# EAGLE design manyMelody (EAGLE 8.7.0)
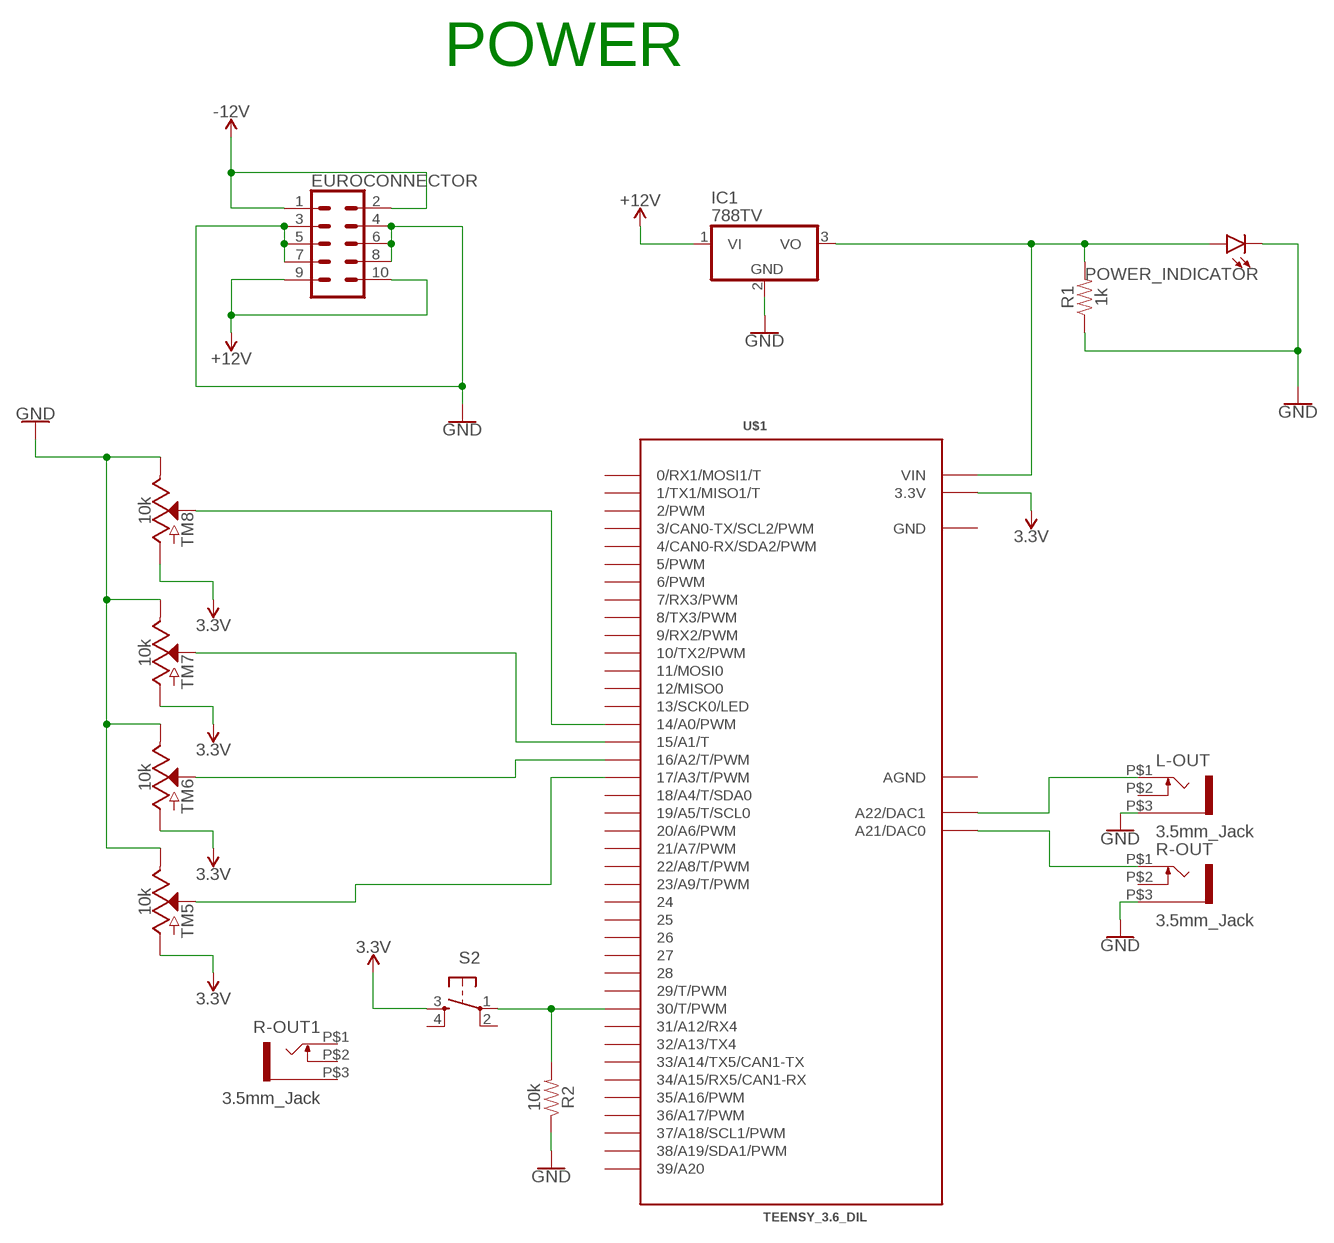
[diagram p0: schematic, sheet 1]

## Parts
EUROCONNECTOR  CONN_05X2SHD  [2X5-SHROUDED]
IC1  788TV  [TO220V]
L-OUT  3.5mm_Jack  WQP-PJ301M-12_JACK  [WQP-PJ301M-12_JACK]
POWER_INDICATOR  LED5MM  [LED_5MM]
R1  1k  1KOHM-HORIZ-1/4W-5%  [AXIAL-0.3]
R2  10k  1KOHM-HORIZ-1/4W-5%  [AXIAL-0.3]
R-OUT  3.5mm_Jack  WQP-PJ301M-12_JACK  [WQP-PJ301M-12_JACK]
R-OUT1  3.5mm_Jack  WQP-PJ301M-12_JACK  [WQP-PJ301M-12_JACK]
S2  TAC_SWITCHPTH  [TACTILE-PTH]
TM5  10k  POTENTIOMETER-PTH-9MM-1/20W-20%  [POT-PTH-ALPS]
TM6  10k  POTENTIOMETER-PTH-9MM-1/20W-20%  [POT-PTH-ALPS]
TM7  10k  POTENTIOMETER-PTH-9MM-1/20W-20%  [POT-PTH-ALPS]
TM8  10k  POTENTIOMETER-PTH-9MM-1/20W-20%  [POT-PTH-ALPS]
U$1  TEENSY_3.6_DIL  [TEENSY_3.6_DIL]

## Nets
3.3V: S2.3 TM5.P$3(A) TM6.P$3(A) TM7.P$3(A) TM8.P$3(A) U$1.3.3V U$1.3.3V3(3.3V)
5V: IC1.3(VO) POWER_INDICATOR.A R1.P$2 U$1.VIN
+12V: EUROCONNECTOR.9 EUROCONNECTOR.10 IC1.1(VI)
-12V: EUROCONNECTOR.1 EUROCONNECTOR.2
GND: EUROCONNECTOR.3 EUROCONNECTOR.4 EUROCONNECTOR.5 EUROCONNECTOR.6 EUROCONNECTOR.7 EUROCONNECTOR.8 IC1.2(GND) L-OUT.P$3 POWER_INDICATOR.K(C) R1.P$1 R2.P$1 R-OUT.P$3 TM5.P$1(E) TM6.P$1(E) TM7.P$1(E) TM8.P$1(E)
N$3: R2.P$2 S2.1 U$1.30(30/T/PWM)
N$9: L-OUT.P$1 U$1.A22(A22/DAC1)
N$10: R-OUT.P$1 U$1.A21(A21/DAC0)
N$11: TM8.P$2(S) U$1.14/A0(14/A0/PWM)
N$12: TM7.P$2(S) U$1.15/A1(15/A1/T)
N$13: TM6.P$2(S) U$1.16/A2(16/A2/T/PWM)
N$14: TM5.P$2(S) U$1.17/A3(17/A3/T/PWM)
Unconnected: L-OUT.P$2 R-OUT1.P$1 R-OUT1.P$2 R-OUT1.P$3 R-OUT.P$2 S2.2 S2.4 U$1.0(0/RX1/MOSI1/T) U$1.1(1/TX1/MISO1/T) U$1.2(2/PWM) U$1.3(3/CAN0-TX/SCL2/PWM) U$1.4(4/CAN0-RX/SDA2/PWM) U$1.5(5/PWM) U$1.6(6/PWM) U$1.7(7/RX3/PWM) U$1.8(8/TX3/PWM) U$1.9(9/RX2/PWM) U$1.10(10/TX2/PWM) U$1.11(11/MOSI0) U$1.12(12/MISO0) U$1.13(13/SCK0/LED) U$1.18/A4(18/A4/T/SDA0) U$1.19/A5(19/A5/T/SCL0) U$1.20/A6(20/A6/PWM) U$1.21/A7(21/A7/PWM) U$1.22/A8(22/A8/T/PWM) U$1.23/A9(23/A9/T/PWM) U$1.24 U$1.25 U$1.26 U$1.27 U$1.28 U$1.29(29/T/PWM) U$1.31/A12(31/A12/RX4) U$1.32/A13(32/A13/TX4) U$1.33/A14(33/A14/TX5/CAN1-TX) U$1.34/A15(34/A15/RX5/CAN1-RX) U$1.35/A16(35/A16/PWM) U$1.36/A17(36/A17/PWM) U$1.37/A18(37/A18/SCL1/PWM) U$1.38/A19(38/A19/SDA1/PWM) U$1.39/A20

## Notes on the sheet
- POWER

## Power pins joined to a net without a drawn wire
AGND: U$1.AGND
GND: U$1.GND U$1.GND1(GND)

## Library data of the parts
EUROCONNECTOR = SparkFun-Connectors:CONN_05X2: Multi connection point. Often used as Generic Header-pin footprint for 0.1 inch spaced/style header connections For AVR SPI programming port, see special device with nice symbol: "AVR_SPI_PROG_5x2.dev" You can populate with any combo of single row headers, but if you'd like an exact match, check these: 2x5 AVR ICSP Male Header <https://www.sparkfun.com/products/778> (PRT-00778) 2x5 Pin Shrouded Header <https://www.sparkfun.com/products/8506> (PRT-08506) On any of the 0.1 inch spaced packages, you can populate with these: Break Away Headers - Straight <https://www.sparkfun.com/products/116> (PRT-00116) Break Away Male Headers - Right Angle <https://www.sparkfun.com/products/553> (PRT-00553) Female Headers <https://www.sparkfun.com/products/115> (PRT-00115) Break Away Headers - Machine Pin <https://www.sparkfun.com/products/117> (PRT-00117) Break Away Female Headers - Swiss Machine Pin <https://www.sparkfun.com/products/743> (PRT-00743) Special note: the shrouded connector mates well with our 5x2 ribbon cables: 2x5 Pin IDC Ribbon Cable <https://www.sparkfun.com/products/8535> (PRT-08535); PROD_ID: CONN-08671; SF_ID: PRT-08506
IC1 = linear:78*: Positive VOLTAGE REGULATOR Source: http://cache.national.com/ds/LM/LM78L05.pdf http://www.fairchildsemi.com/ds/LM/LM7805.pdf
L-OUT R-OUT R-OUT1 = thonkiconn:WQP-PJ301M-12_JACK
POWER_INDICATOR = SparkFun-LED:LED: LED (Generic) Standard schematic elements and footprints for 5mm, 3mm, 1206, and 0603 sized LEDs. Generic LEDs with no color specified.
R1 = SparkFun-Resistors:1KOHM: 1kΩ resistor A resistor is a passive two-terminal electrical component that implements electrical resistance as a circuit element. Resistors act to reduce current flow, and, at the same time, act to lower voltage levels within circuits. - Wikipedia; PROD_ID: RES-08380
R2 = SparkFun-Resistors:1KOHM: 1kΩ resistor A resistor is a passive two-terminal electrical component that implements electrical resistance as a circuit element. Resistors act to reduce current flow, and, at the same time, act to lower voltage levels within circuits. - Wikipedia; PROD_ID: RES-08380; VALUE: 1k
S2 = SparkFun-Retired:TAC_SWITCH: Momentary Switch Button commonly used for reset or general input. Spark Fun Electronics SKU : COM-00097 SMT- SWCH-08247
TM5-TM8 = SparkFun-Resistors:POTENTIOMETER: Potentiometer (Pot) Three-terminal potentiometers, with an adjustable wiper and two adjustable resistors. A pot can be used to create a configurable voltage divider, or as a variable resistor. Variants ALPS_POT and ALPS_POT_KIT - PTH, breadboard compatible, 9mm square pots Rotary Potentiometer - Linear (10k ohm) <https://www.sparkfun.com/products/9288> (COM-09288) The KIT variant exposes copper on only one side of the PTH pad, so the part can only be assembled on one side of the PCB. Useful for beginner soldering kits.; PROD_ID: RES-09177; SF_SKU: COM-09288
U$1 = Teensy_3_and_LC_Series_Boards_v1.4:TEENSY_3.6_DIL: Teensy 3.6 DIL Package

## Board
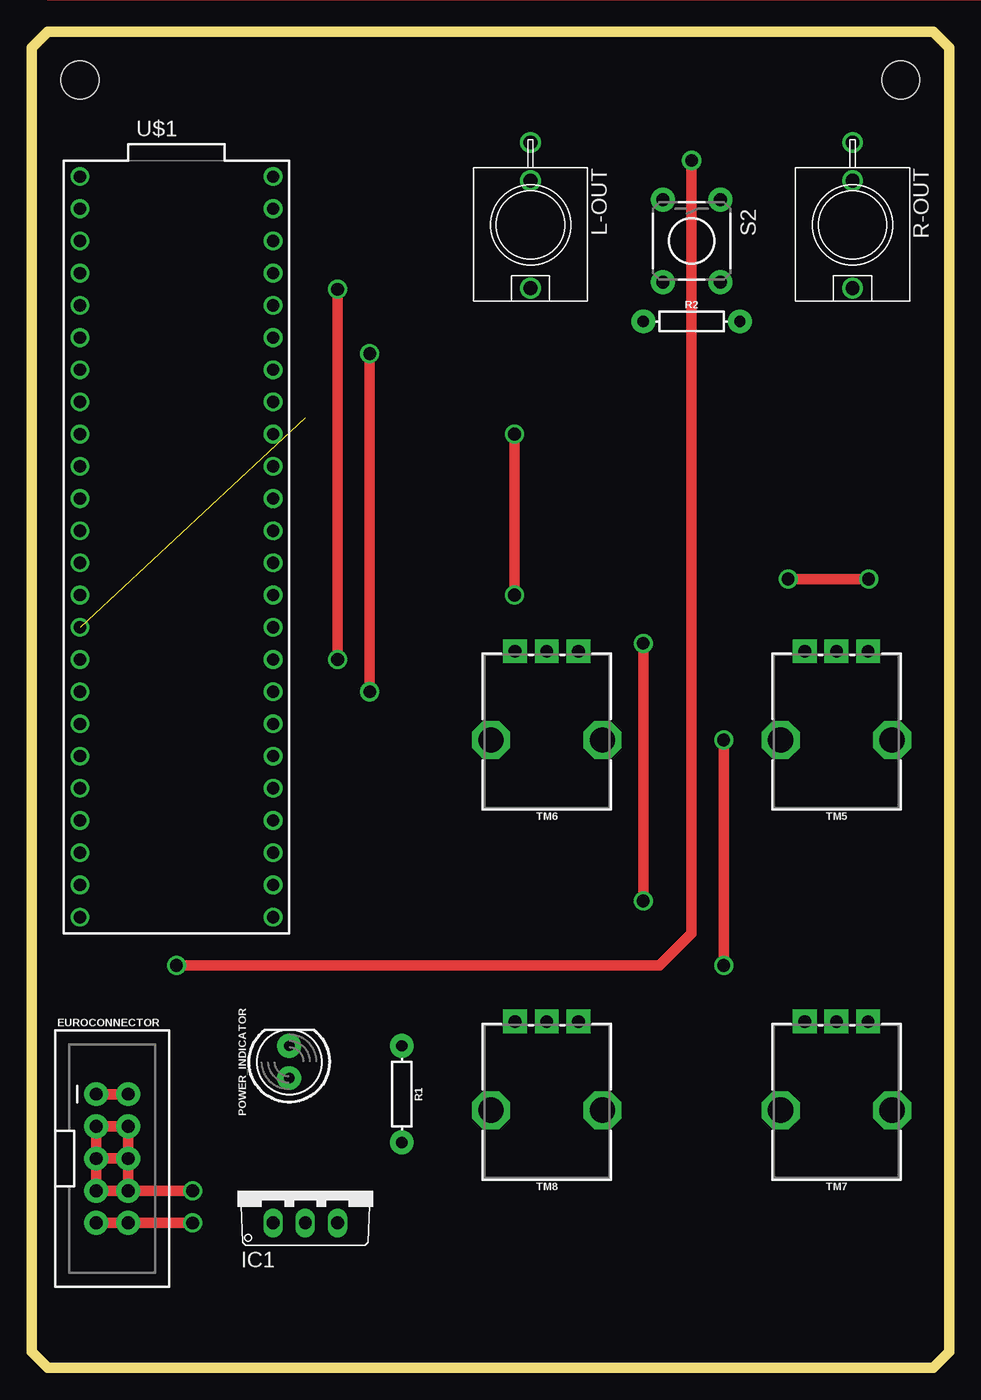
[diagram p1: board, top side]
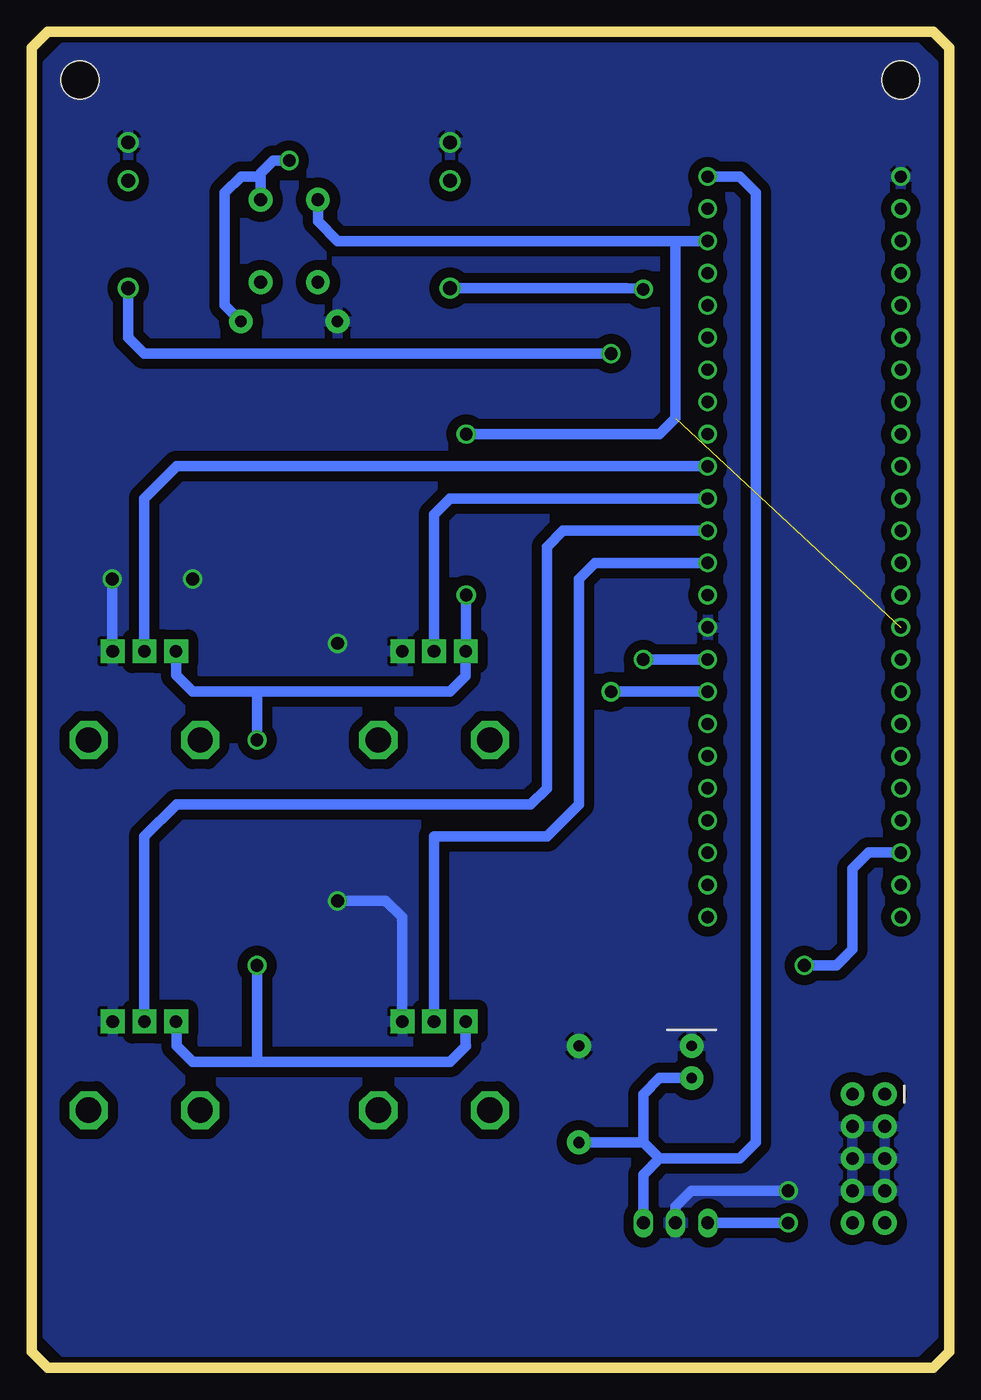
[diagram p2: board, bottom side, seen from below]

Size 72.39 x 105.41 mm. Coordinates in mm from the lower left corner, seen from the top.
Outline: 0,1.27 1.27,0 71.12,0 72.39,1.27 72.39,104.14 71.12,105.41 1.27,105.41 0,104.14 0,1.27
Copper layers (1*16): Top 0.035mm / dielectric 1.5mm / Bottom 0.035mm
Design rules "OthermillDRC_1_32_v2": minimum track width 8mil, minimum drill 0.8mm, track to track 0.794003125mm, track to pad 0.794003125mm, pad to pad 0.794003125mm, via to via 0.794003125mm, smd to smd 0mil, copper to edge 0mil, drill to drill 1mil, minimum pad ring 10mil, minimum via ring 10mil, stop-mask expansion 1mil, vias tented up to drill 30mil, thermal gap 10mil
Holes 3 mm at 68.58,101.6 3.81,101.6

### Footprints (pad centres in the part's own frame; a part is rotated, then mirrored left to right if it is on the bottom)
2X5-SHROUDED = drill 1.016 pad 1.88: 1 -1.27,5.08; 2 1.27,5.08; 3 -1.27,2.54; 4 1.27,2.54; 5 -1.27,0; 6 1.27,0; 7 -1.27,-2.54; 8 1.27,-2.54; 9 -1.27,-5.08; 10 1.27,-5.08
TO220V = drill 1.016 long: 1 -2.54,-2.54; 2 0,-2.54; 3 2.54,-2.54
WQP-PJ301M-12_JACK = drill 1.1: P$1 0,5; P$2 0,-3.5; P$3 0,-6.5
LED_5MM = drill 0.813 pad 1.88: A -1.27,0; K 1.27,0
AXIAL-0.3 = drill 0.9 pad 1.88: P$1 -3.81,0; P$2 3.81,0
TACTILE-PTH = drill 1.016 pad 1.88: 1 -3.251,2.261; 2 3.251,2.261; 3 -3.251,-2.261; 4 3.251,-2.261
POT-PTH-ALPS = drill 1 pad 1.88 square: P$1 7,-2.5; P$2 7,0; P$3 7,2.5 | drill 2 octagon: P$4 0,-4.4; P$5 0,4.4
TEENSY_3.6_DIL = drill 0.965: 0 -7.62,25.4; 1 -7.62,22.86; 2 -7.62,20.32; 3 -7.62,17.78; 3.3V 7.62,22.86; 3.3V3 -7.62,-7.62; 4 -7.62,15.24; 5 -7.62,12.7; 6 -7.62,10.16; 7 -7.62,7.62; 8 -7.62,5.08; 9 -7.62,2.54; 10 -7.62,0; 11 -7.62,-2.54; 12 -7.62,-5.08; 13 7.62,-5.08; 14/A0 7.62,-2.54; 15/A1 7.62,0; 16/A2 7.62,2.54; 17/A3 7.62,5.08; 18/A4 7.62,7.62; 19/A5 7.62,10.16; 20/A6 7.62,12.7; 21/A7 7.62,15.24; 22/A8 7.62,17.78; 23/A9 7.62,20.32; 24 -7.62,-10.16; 25 -7.62,-12.7; 26 -7.62,-15.24; 27 -7.62,-17.78; 28 -7.62,-20.32; 29 -7.62,-22.86; 30 -7.62,-25.4; 31/A12 -7.62,-27.94; 32/A13 -7.62,-30.48; 33/A14 7.62,-30.48; 34/A15 7.62,-27.94; 35/A16 7.62,-25.4; 36/A17 7.62,-22.86; 37/A18 7.62,-20.32; 38/A19 7.62,-17.78; 39/A20 7.62,-15.24; A21 7.62,-12.7; A22 7.62,-10.16; AGND 7.62,25.4; GND -7.62,27.94; GND1 7.62,-7.62; VIN 7.62,27.94

### Placement (x,y rotation side)
EUROCONNECTOR  6.35,16.51 0 top
IC1  21.59,13.97 0 top
L-OUT  39.37,90.17 180 top
POWER_INDICATOR  20.32,24.13 90 top
R1  29.21,21.59 270 top
R2  52.07,82.55 0 top
R-OUT  64.77,90.17 180 top
R-OUT1  -115.57,-110.49 0 top  (outside the outline)
S2  52.07,88.9 270 top
TM5  63.5,49.53 90 top
TM6  40.64,49.53 90 top
TM7  63.5,20.32 90 top
TM8  40.64,20.32 90 top
U$1  11.43,66.04 0 top

### Tracks (layer width: path | path; a pad name or v marks a point on that pad's centre or on a via)
3.3V  (via drill 1)  (1 unrouted)
  Top 0.813: v38.1,73.66 v38.1,60.96 | v54.61,31.75 v54.61,49.53
  Bottom 0.813: 54.61,53.34 39.37,53.34 38.14,54.57 TM6.P$3 38.1,56.57 v38.1,60.96 | 54.61,53.34 59.69,53.34 61,54.65 TM5.P$3 | TM8.P$3 38.14,25.44 38.1,25.4 39.37,24.13 54.61,24.13 | 54.61,24.13 59.69,24.13 60.96,25.4 60.96,27.28 TM7.P$3 | S2.3 49.81,90.45 48.26,88.9 21.59,88.9 | U$1.3.3V 21.59,88.9 | v38.1,73.66 22.86,73.66 21.59,74.93 21.59,88.9 | 54.61,24.13 v54.61,31.75 | v54.61,49.53 54.61,53.34
5V
  Bottom 0.813: IC1.3 24.13,15.24 22.86,16.51 | 22.86,16.51 16.51,16.51 15.24,17.78 15.24,92.71 16.51,93.98 U$1.VIN | 22.86,16.51 24.13,17.78 | 24.13,17.78 24.13,21.59 22.86,22.86 POWER_INDICATOR.A | 24.13,17.78 R1.P$2
+12V  (via drill 1)
  Top 0.813: EUROCONNECTOR.9 EUROCONNECTOR.10 v12.7,11.43
  Bottom 0.813: v12.7,11.43 IC1.1
-12V
  Top 0.813: EUROCONNECTOR.1 EUROCONNECTOR.2
GND  (via drill 1)
  Top 0.813: EUROCONNECTOR.8 EUROCONNECTOR.7 EUROCONNECTOR.5 | EUROCONNECTOR.8 EUROCONNECTOR.6 | EUROCONNECTOR.6 EUROCONNECTOR.5 | EUROCONNECTOR.5 EUROCONNECTOR.3 EUROCONNECTOR.4 EUROCONNECTOR.6 | EUROCONNECTOR.8 v12.7,13.97 | v48.26,36.83 v48.26,57.15 | v66.04,62.23 v59.69,62.23
  Bottom 0.813: v12.7,13.97 20.32,13.97 21.59,12.7 IC1.2 | TM8.P$1 43.18,27.36 43.18,35.56 44.45,36.83 v48.26,36.83 | TM5.P$1 66.04,56.57 v66.04,62.23
  pour Bottom: 1.27,102.87 1.27,2.54 2.54,1.27 69.85,1.27 71.12,2.54 71.12,102.87 69.85,104.14 2.54,104.14
N$3  (via drill 1)
  Top 0.813: v11.43,31.75 49.53,31.75 52.07,34.29 v52.07,95.25
  Bottom 0.813: U$1.30 6.35,40.64 7.62,39.37 7.62,33.02 8.89,31.75 v11.43,31.75 | v52.07,95.25 53.34,95.25 54.33,94.26 54.33,93.98 | 54.33,93.98 S2.1 | 54.33,93.98 55.88,93.98 57.15,92.71 57.15,83.82 R2.P$2
N$9  (via drill 1)
  Top 0.813: v24.13,55.88 v24.13,85.09
  Bottom 0.813: U$1.A22 v24.13,55.88 | v24.13,85.09 25.48,85.17 L-OUT.P$1
N$10  (via drill 1)
  Top 0.813: v26.67,53.34 v26.67,80.01
  Bottom 0.813: U$1.A21 v26.67,53.34 | v26.67,80.01 63.5,80.01 64.77,81.28 R-OUT.P$1
N$11
  Bottom 0.813: TM8.P$2 40.64,41.91 31.75,41.91 29.21,44.45 29.21,62.23 27.94,63.5 U$1.14/A0
N$12
  Bottom 0.813: TM7.P$2 63.5,41.91 60.96,44.45 33.02,44.45 31.75,45.72 31.75,64.77 30.48,66.04 U$1.15/A1
N$13
  Bottom 0.813: TM6.P$2 40.64,67.31 39.37,68.58 U$1.16/A2
N$14
  Bottom 0.813: U$1.17/A3 60.96,71.12 63.5,68.58 TM5.P$2
(copper drawn outside any net)
  shapes: Top area x1